# EAGLE design RectangularThing-LEDs (EAGLE 7.7.0)
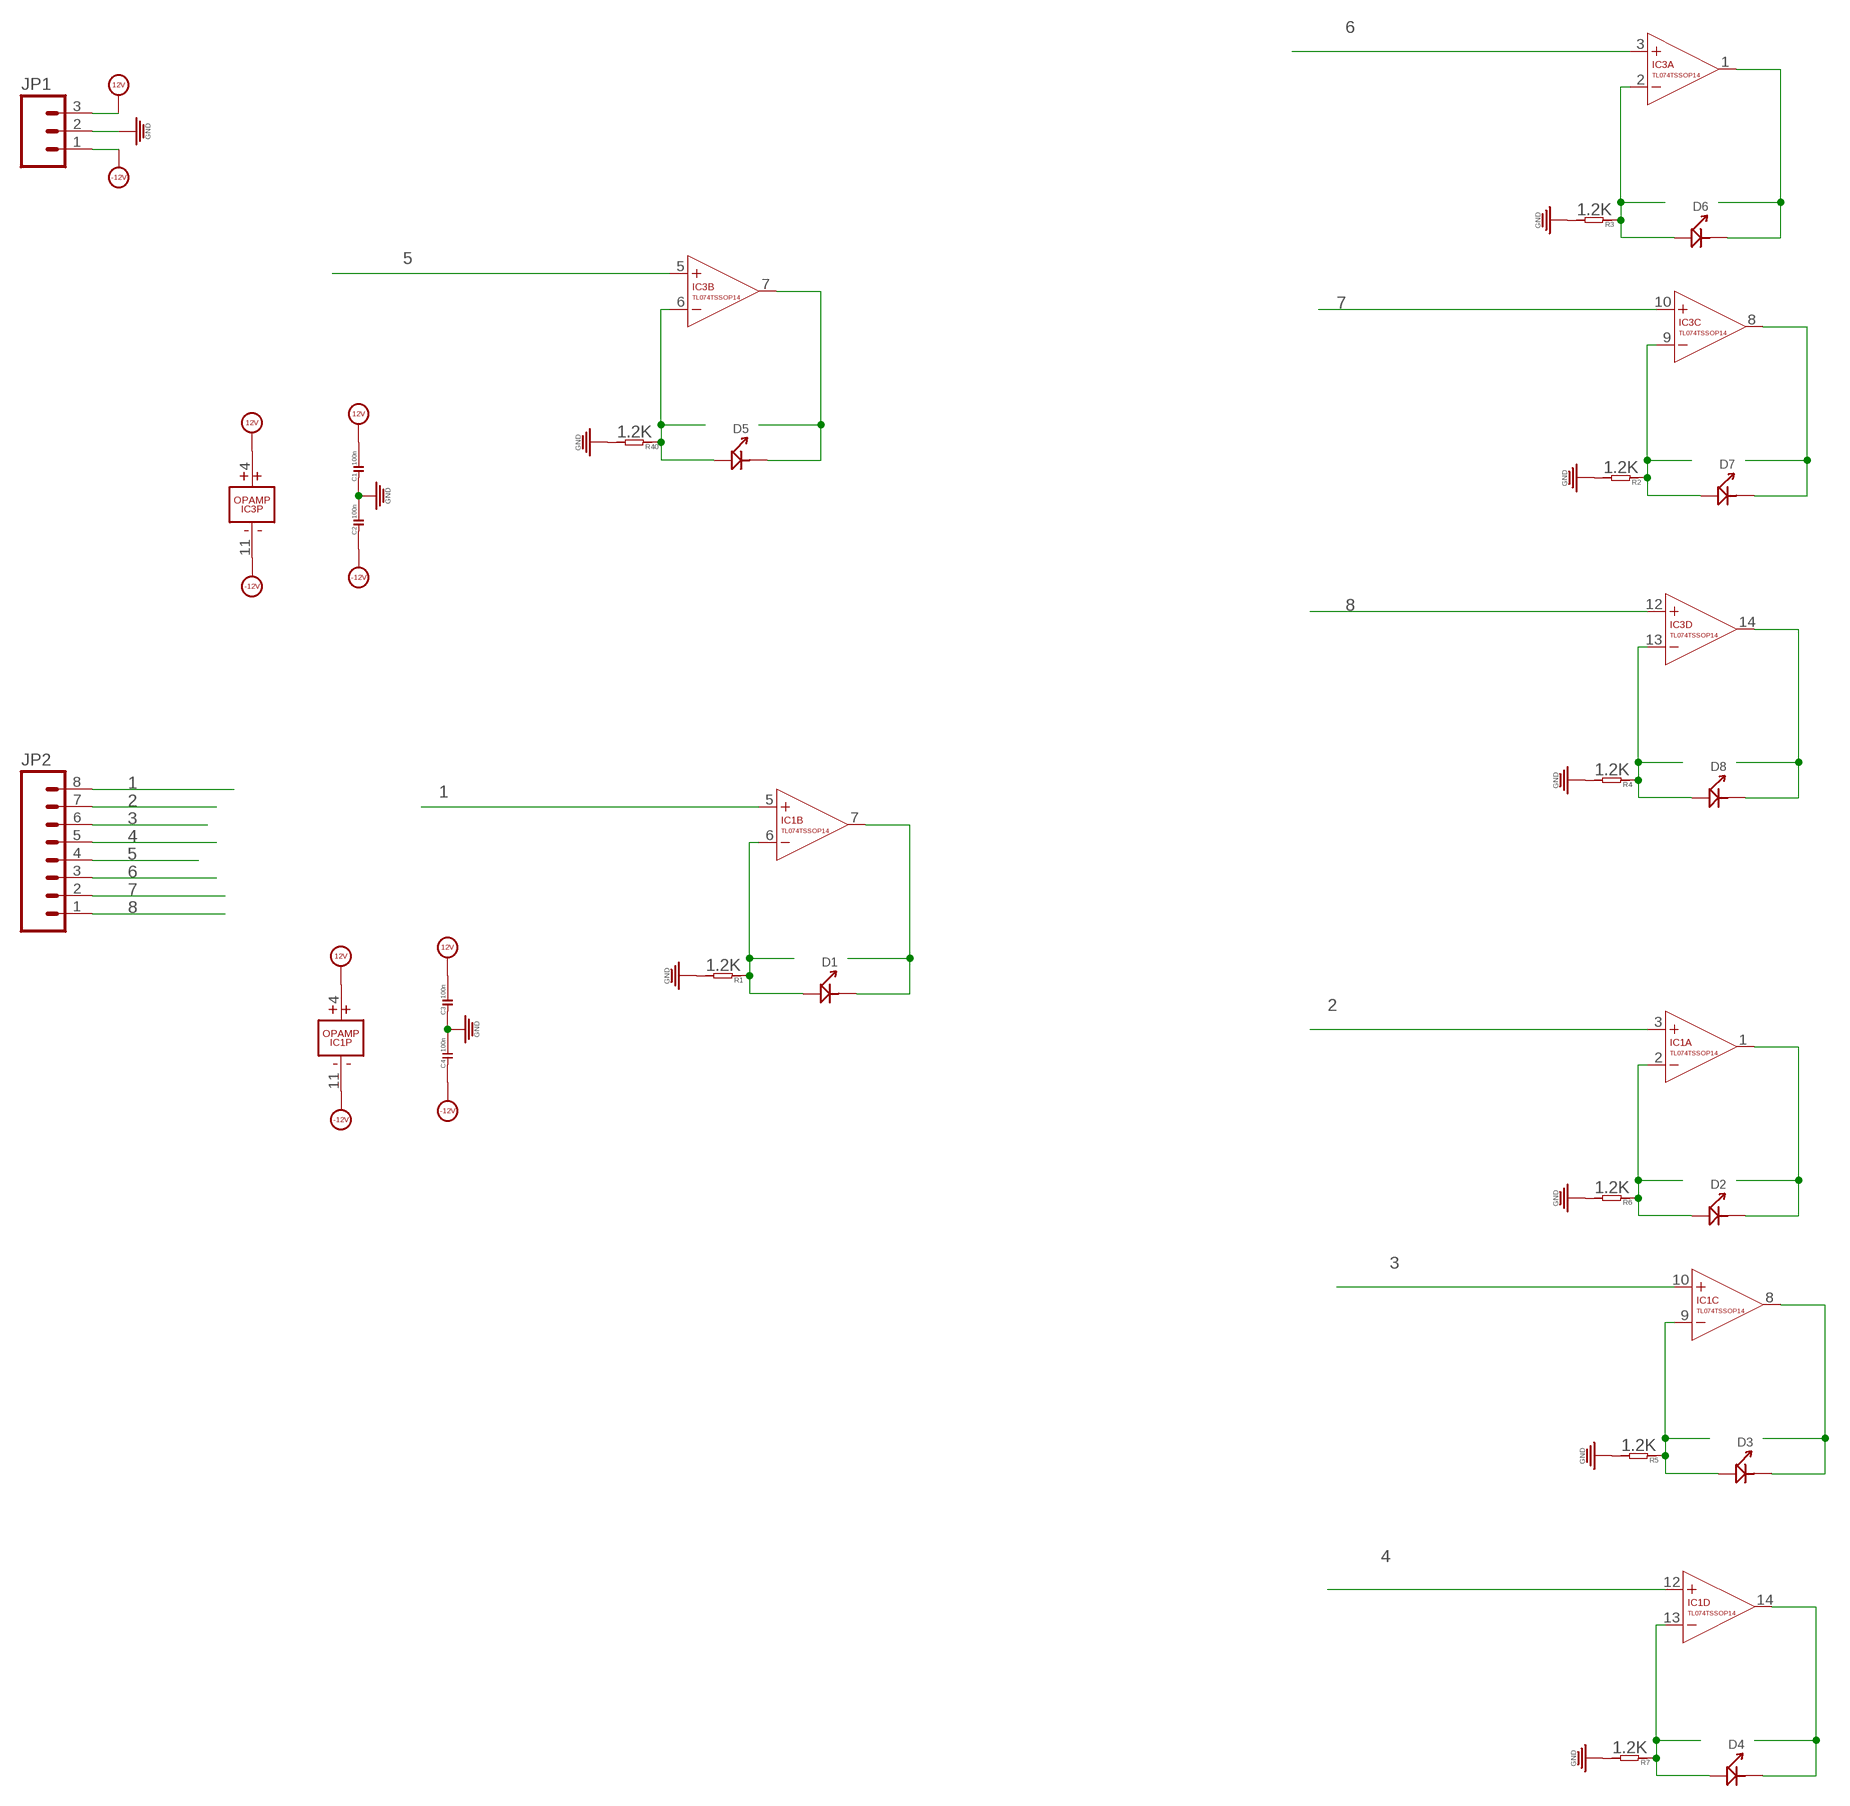
[diagram p0: schematic, sheet 1]

## Parts
C1  100n  C-0603  [C0603]
C2  100n  C-0603  [C0603]
C3  100n  C-0603  [C0603]
C4  100n  C-0603  [C0603]
D1  LED  [LED0603]
D2  LED  [LED0603]
D3  LED  [LED0603]
D4  LED  [LED0603]
D5  LED  [LED0603]
D6  LED  [LED0603]
D7  LED  [LED0603]
D8  LED  [LED0603]
IC1  TL074TSSOP14  [TSSOP14]
IC3  TL074TSSOP14  [TSSOP14]
JP1  M03PTH  [1X03]
JP2  M08LONGPADS  [1X08_LONGPADS]
R1  1.2K  R-0603  [R0603]
R2  1.2K  R-0603  [R0603]
R3  1.2K  R-0603  [R0603]
R4  1.2K  R-0603  [R0603]
R5  1.2K  R-0603  [R0603]
R6  1.2K  R-0603  [R0603]
R7  1.2K  R-0603  [R0603]
R40  1.2K  R-0603  [R0603]

## Nets
1: IC1.5(B:+IN) JP2.8
2: IC1.3(A:+IN) JP2.7
3: IC1.10(C:+IN) JP2.6
4: IC1.12(D:+IN) JP2.5
5: IC3.5(B:+IN) JP2.4
6: IC3.3(A:+IN) JP2.3
7: IC3.10(C:+IN) JP2.2
8: IC3.12(D:+IN) JP2.1
12V: C1.2 C3.2 IC1.4(P:V+) IC3.4(P:V+) JP1.3
-12V: C2.1 C4.1 IC1.11(P:V-) IC3.11(P:V-) JP1.1
GND: C1.1 C2.2 C3.1 C4.2 JP1.2 R1.2 R2.2 R3.2 R4.2 R5.2 R6.2 R7.2 R40.2
N$2: D1.+ IC1.6(B:-IN) R1.1
N$3: D1.- IC1.7(B:OUT)
N$5: D7.+ IC3.9(C:-IN) R2.1
N$6: D7.- IC3.8(C:OUT)
N$9: D6.+ IC3.2(A:-IN) R3.1
N$10: D6.- IC3.1(A:OUT)
N$12: D8.+ IC3.13(D:-IN) R4.1
N$13: D8.- IC3.14(D:OUT)
N$15: D3.+ IC1.9(C:-IN) R5.1
N$16: D3.- IC1.8(C:OUT)
N$18: D2.+ IC1.2(A:-IN) R6.1
N$19: D2.- IC1.1(A:OUT)
N$21: D4.+ IC1.13(D:-IN) R7.1
N$22: D4.- IC1.14(D:OUT)
N$44: D5.+ IC3.6(B:-IN) R40.1
N$45: D5.- IC3.7(B:OUT)

## Library data of the parts
C1-C4 = OPL:C*
D1-D8 = OPL:LED*: LED
IC1 IC3 = EurorackModularParts:TL074: OP AMP
JP1 = SparkFun-Connectors:M03: Header 3 Standard 3-pin 0.1" header. Use with straight break away headers (SKU : PRT-00116), right angle break away headers (PRT-00553), swiss pins (PRT-00743), machine pins (PRT-00117), and female headers (PRT-00115). Molex polarized connector foot print use with SKU : PRT-08232 with associated crimp pins and housings.
JP2 = SparkFun-Connectors:M08: Header 8 Standard 8-pin 0.1" header. Use with straight break away headers (SKU : PRT-00116), right angle break away headers (PRT-00553), swiss pins (PRT-00743), machine pins (PRT-00117), and female headers (PRT-00115).
R1-R7 R40 = OPL:R*

## Net classes
0 default: width 0.203 mm

## Board
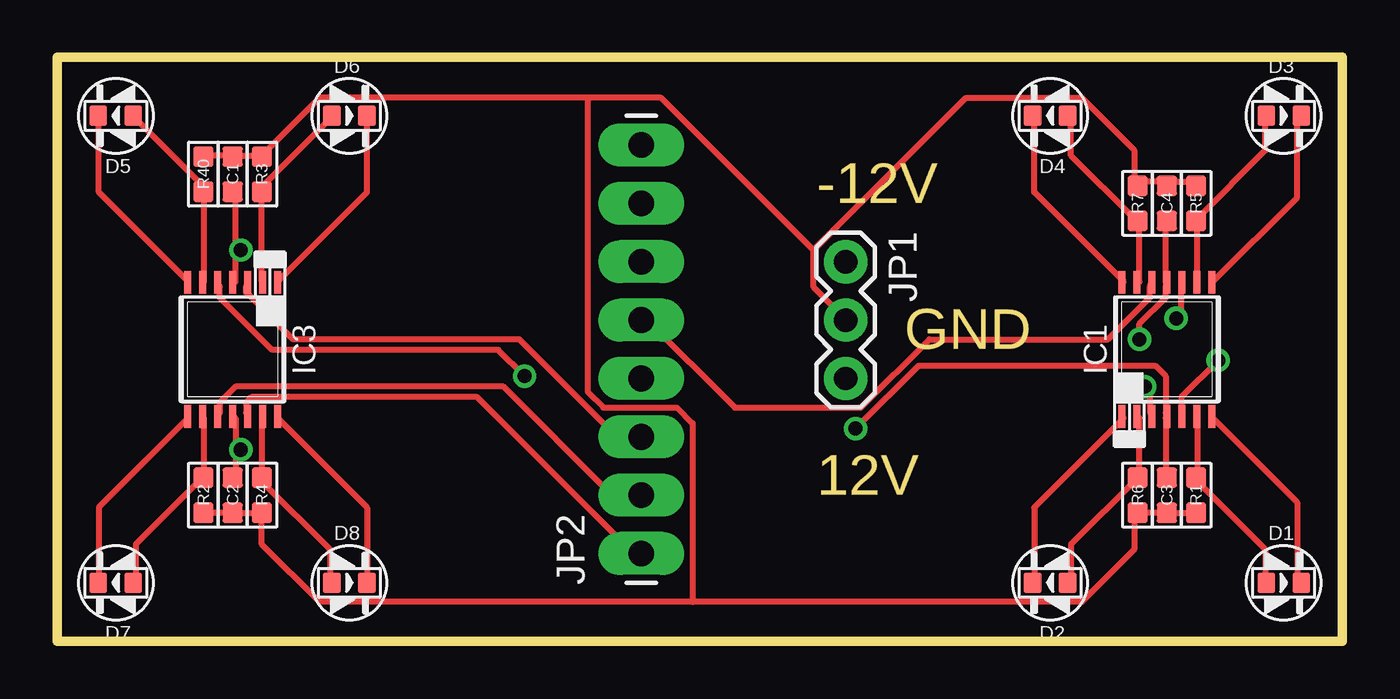
[diagram p1: board, top side]
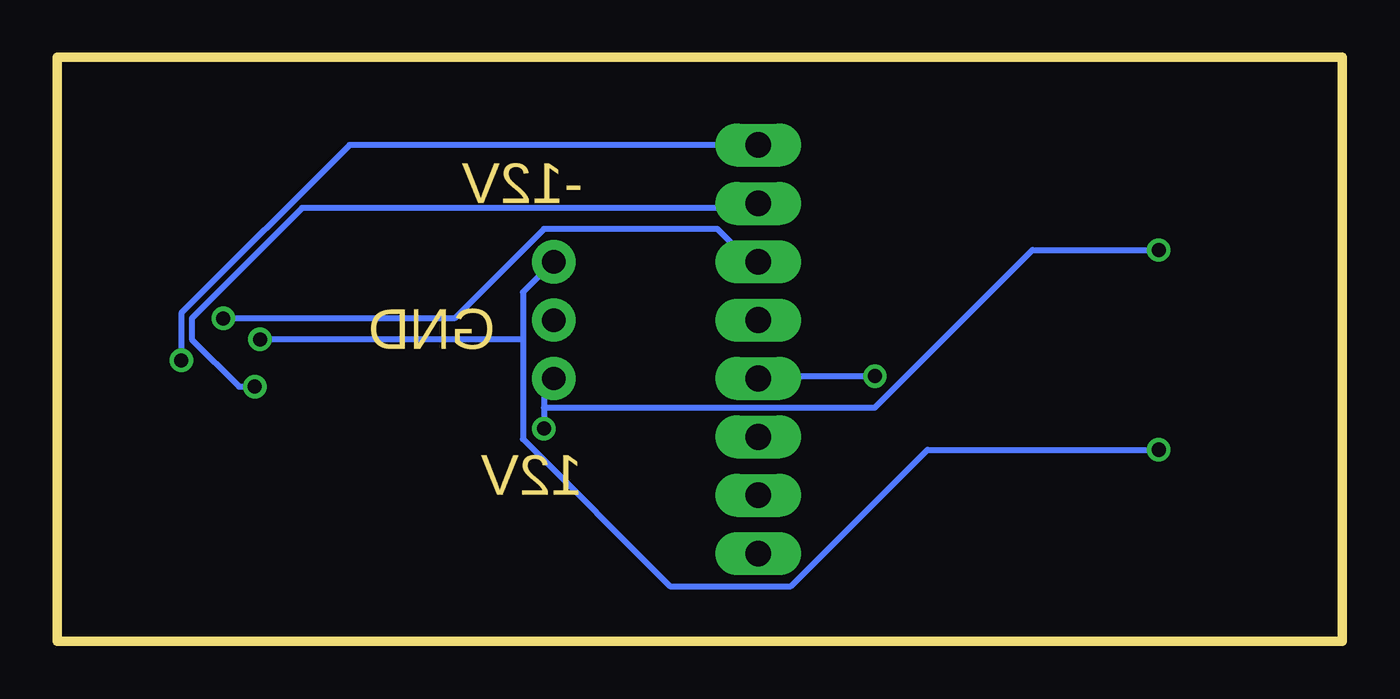
[diagram p2: board, bottom side, seen from below]

Size 55.88 x 25.4 mm. Coordinates in mm from the lower left corner, seen from the top.
Outline: 0,25.4 55.88,25.4 55.88,0 0,0 0,25.4
Copper layers (1*16): Top 0.035mm / dielectric 1.5mm / Bottom 0.035mm
Design rules "default": minimum track width 10mil, minimum drill 24mil, track to track 8mil, track to pad 8mil, pad to pad 8mil, via to via 8mil, smd to smd 8mil, copper to edge 40mil, drill to drill 8mil, minimum pad ring 10mil, minimum via ring 8mil, stop-mask expansion 4mil, vias tented up to drill 0mil, thermal gap 10mil

### Footprints (pad centres in the part's own frame; a part is rotated, then mirrored left to right if it is on the bottom)
C0603 = smd 0.889 x 0.889: 1 -0.762,0; 2 0.762,0
LED0603 = smd 0.762 x 0.889: + -0.762,0; - 0.762,0
TSSOP14 = smd 0.305 x 0.991: 1 -1.95,-2.918; 2 -1.3,-2.918; 3 -0.65,-2.918; 4 0,-2.918; 5 0.65,-2.918; 6 1.3,-2.918; 7 1.95,-2.918; 8 1.95,2.918; 9 1.3,2.918; 10 0.65,2.918; 11 0,2.918; 12 -0.65,2.918; 13 -1.3,2.918; 14 -1.95,2.918
1X03 = drill 1.016 pad 1.88: 1 0,0; 2 2.54,0; 3 5.08,0
1X08_LONGPADS = drill 1.118 pad 1.88 long: 1 0,0; 2 2.54,0; 3 5.08,0; 4 7.62,0; 5 10.16,0; 6 12.7,0; 7 15.24,0; 8 17.78,0
R0603 = smd 0.889 x 0.889: 1 -0.762,0; 2 0.762,0

### Placement (x,y rotation side)
C1  7.62,20.32 270 top
C2  7.62,6.35 270 top
C3  48.26,6.35 90 top
C4  48.26,19.05 90 top
D1  53.34,2.54 0 top
D2  43.18,2.54 180 top
D3  53.34,22.86 0 top
D4  43.18,22.86 180 top
D5  2.54,22.86 180 top
D6  12.7,22.86 0 top
D7  2.54,2.54 180 top
D8  12.7,2.54 0 top
IC1  48.26,12.7 0 top
IC3  7.62,12.7 180 top
JP1  34.29,16.51 270 top
JP2  25.4,3.81 90 top
R1  49.53,6.35 270 top
R2  6.35,6.35 270 top
R3  8.89,20.32 90 top
R4  8.89,6.35 270 top
R5  49.53,19.05 90 top
R6  46.99,6.35 270 top
R7  46.99,19.05 90 top
R40  6.35,20.32 90 top

### Tracks (layer width: path | path; a pad name or v marks a point on that pad's centre or on a via)
1  (via drill 0.61)
  Top 0.254: v50.49,12.22 48.9,10.62 48.9,9.93 IC1.5
  Bottom 0.254: v50.49,12.22 50.49,14.28 43.18,21.59 JP2.8
2  (via drill 0.61)
  Top 0.254: v47.3,11.07 47.52,10.85 47.52,9.93 IC1.3
  Bottom 0.254: v47.3,11.07 47.98,11.07 50.04,13.13 50.04,14.05 45.24,18.85 25.58,18.85 JP2.7
3  (via drill 0.61)
  Top 0.254: v48.67,14.05 48.9,14.28 48.9,15.42 IC1.10
  Bottom 0.254: v48.67,14.05 38.61,14.05 34.72,17.93 27.18,17.93 25.58,16.33 JP2.6
4
  Top 0.254: IC1.12 47.52,15.42 47.52,14.96 45.7,13.13 37.92,13.13 34.95,10.16 29.46,10.16 25.58,14.05 JP2.5
5  (via drill 0.61)
  Top 0.254: v20.32,11.53 19.18,12.68 9.35,12.68 7.06,14.96 7.06,15.42 IC3.5
  Bottom 0.254: v20.32,11.53 25.35,11.53 JP2.4
6
  Top 0.254: IC3.3 8.2,15.42 8.2,15.19 10.26,13.13 20.09,13.13 24.21,9.02 25.35,9.02 JP2.3
7
  Top 0.254: IC3.10 7.06,9.93 7.06,10.39 7.75,11.07 19.41,11.07 23.98,6.5 25.35,6.5 JP2.2
8
  Top 0.254: IC3.12 8.2,9.93 8.2,10.39 8.43,10.62 18.26,10.62 24.89,3.99 25.35,3.99 JP2.1
12V  (via drill 0.61)
  Top 0.254: 7.75,17.02 7.75,15.65 IC3.4 | 7.75,17.02 7.75,19.53 C1.2 | C3.2 48.21,7.19 48.21,9.7 IC1.4 48.21,9.93 48.21,11.53 47.75,11.99 37.47,11.99 v34.72,9.25 | v7.98,17.02 7.75,17.02
  Bottom 0.254: 34.72,10.16 34.72,11.07 34.49,11.3 JP1.3 | 34.72,10.16 v34.72,9.25 | v7.98,17.02 13.46,17.02 20.32,10.16 34.72,10.16
-12V  (via drill 0.61)
  Top 0.254: C4.1 48.21,18.16 48.21,15.65 IC1.11 48.21,15.42 48.21,14.96 47.07,13.82 v47.07,13.13 | 7.75,8.33 7.75,9.7 IC3.11 | 7.75,8.33 7.75,7.19 C2.1 | v7.98,8.33 7.75,8.33
  Bottom 0.254: v7.98,8.33 18.03,8.33 23.98,2.39 29.23,2.39 35.64,8.79 35.64,13.13 | 35.64,13.13 35.64,15.19 34.49,16.33 JP1.1 | 35.64,13.13 v47.07,13.13
GND
  Top 0.254: R2.2 C2.2 R4.2 8.89,4.22 11.41,1.7 27.64,1.7 | R1.2 C3.1 R6.2 46.84,5.59 46.84,3.99 44.55,1.7 27.64,1.7 | R5.2 49.35,19.99 48.44,19.99 C4.2 48.21,19.99 47.07,19.99 R7.2 46.84,19.99 46.84,21.36 44.55,23.65 39.52,23.65 32.89,17.02 | R40.2 6.37,21.13 7.52,21.13 C1.1 7.75,21.13 8.89,21.13 | 8.89,21.13 11.41,23.65 23.06,23.65 | 23.06,23.65 26.26,23.65 32.89,17.02 | 32.89,17.02 32.89,15.42 34.27,14.05 JP1.2 | 8.89,21.13 R3.2 | 27.64,1.7 27.64,9.47 26.95,10.16 23.75,10.16 23.06,10.85 23.06,23.65
N$2
  Top 0.254: IC1.6 49.58,9.7 49.58,7.19 R1.1 49.58,6.96 52.55,3.99 52.55,2.62 D1.+
N$3
  Top 0.254: D1.- 53.92,2.62 53.92,6.05 50.27,9.7 IC1.7
N$5
  Top 0.254: D7.+ 3.4,2.62 3.4,4.22 6.15,6.96 R2.1 6.37,7.19 6.37,9.7 IC3.9
N$6
  Top 0.254: D7.- 1.8,2.62 1.8,5.82 5.69,9.7 IC3.8
N$9
  Top 0.254: IC3.2 8.89,15.65 R3.1 8.89,19.76 11.86,22.73 D6.+
N$10
  Top 0.254: D6.- 13.46,19.53 9.58,15.65 IC3.1
N$12
  Top 0.254: IC3.13 8.89,9.7 R4.1 8.89,6.96 11.86,3.99 11.86,2.62 D8.+
N$13
  Top 0.254: D8.- 13.46,5.82 9.58,9.7 IC3.14
N$15
  Top 0.254: IC1.9 49.58,15.65 49.58,18.16 R5.1 49.58,18.39 52.55,21.36 52.55,22.73 D3.+
N$16
  Top 0.254: D3.- 53.92,22.73 53.92,19.3 50.27,15.65 IC1.8
N$18
  Top 0.254: D2.+ 44.09,2.62 44.09,4.22 R6.1 47.07,7.19 47.07,9.7 IC1.2
N$19
  Top 0.254: D2.- 42.49,2.62 42.49,5.82 46.38,9.7 IC1.1
N$21
  Top 0.254: IC1.13 47.07,15.65 47.07,18.16 R7.1 46.84,18.39 44.09,21.13 44.09,22.73 D4.+
N$22
  Top 0.254: D4.- 42.49,22.73 42.49,19.53 46.38,15.65 IC1.14
N$44
  Top 0.254: IC3.6 6.37,15.65 6.37,19.53 R40.1 6.37,19.76 3.4,22.73 D5.+
N$45
  Top 0.254: D5.- 1.8,22.73 1.8,19.53 5.69,15.65 IC3.7

### Text on the board
Dimension: -12V | GND | 12V